# EAGLE schematic connectors (EAGLE 9.6.2)
Assembly variants: basic
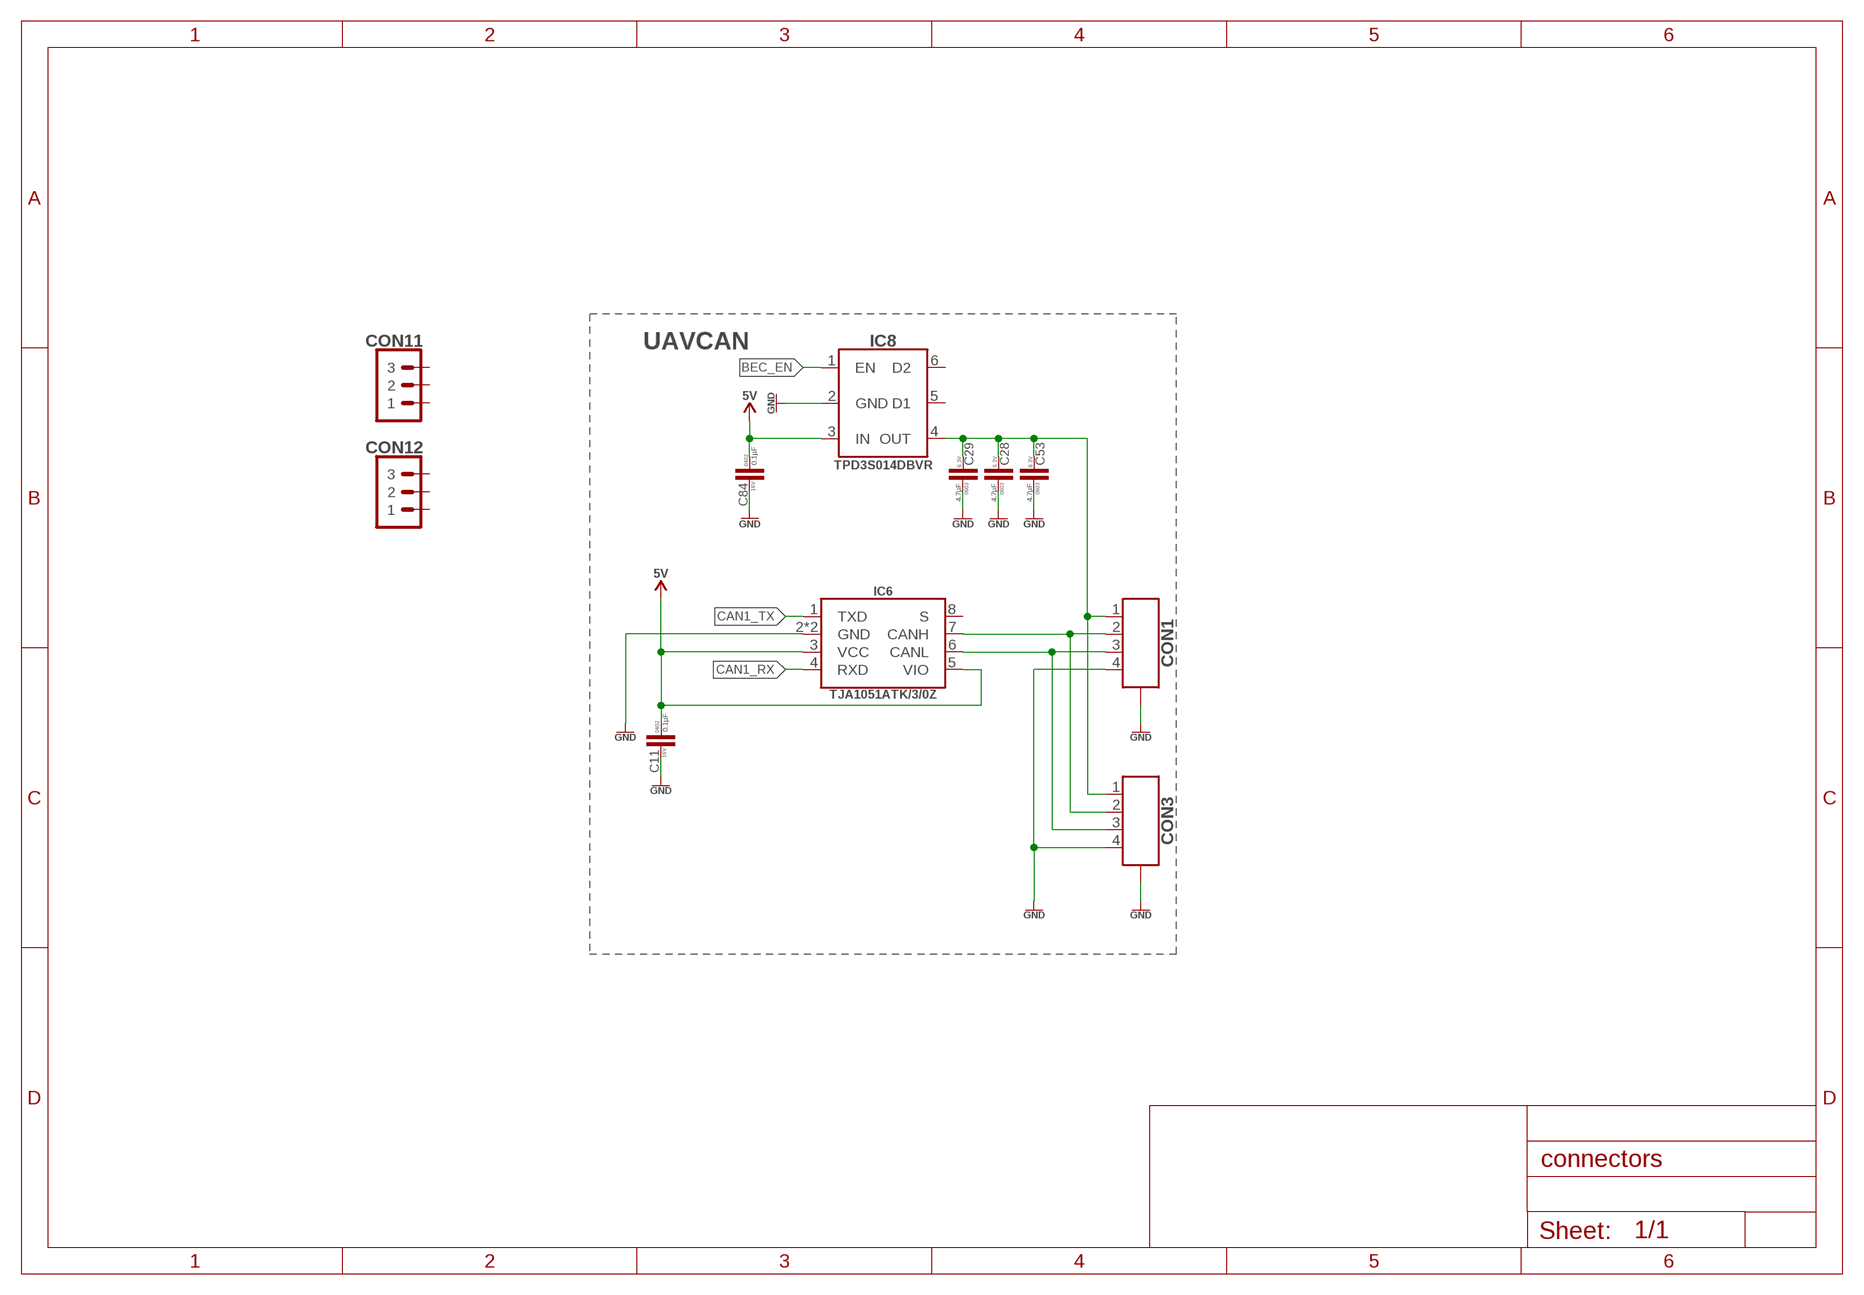
[diagram p0: schematic, sheet 1]

## Parts
C11  0.1µF  C-0402  [C0402]
C28  4.7µF  C-0603  [C0603]
C29  4.7µF  C-0603  [C0603]
C53  4.7µF  C-0603  [C0603]
C84  0.1µF  C-0402  [C0402]
CON1  CON-4P-TABS-JST_GH-RA  [JST_GH-4P-RA]
CON3  CON-4P-TABS-JST_GH-RA  [JST_GH-4P-RA]
CON11  PINHEAD_1X03-2  [1X03-PTH-2]
CON12  PINHEAD_1X03-2  [1X03-PTH-2]
IC6  TJA1051-HVSON8  [SOT782-1]
IC8  TPD3S014DBVR-SOT23-6  [SOT26]

## Nets
BEC_EN: IC8.1(EN)
CAN1_RX: IC6.4(RXD)
CAN1_TX: IC6.1(TXD)
CAN1_VDD: C28.2 C29.2 C53.2 CON1.1 CON3.1 IC8.4(OUT)
GND: C11.2 C28.1 C29.1 C53.1 C84.2 CON1.4 CON1.M$0(GND) CON1.M$1(GND) CON3.4 CON3.M$0(GND) CON3.M$1(GND) IC6.2(GND) IC6.PAD(GND) IC8.2(GND)
N$23: CON1.2 CON3.2 IC6.7(CANH)
N$25: CON1.3 CON3.3 IC6.6(CANL)
VDD_5V: C11.1 C84.1 IC6.3(VCC) IC6.5(VIO) IC8.3(IN) ; supply symbol labelled 5V
Unconnected: CON11.1 CON11.2 CON11.3 CON12.1 CON12.2 CON12.3 IC6.8(S) IC8.5(D1) IC8.6(D2)

## Notes on the sheet
- UAVCAN

## Library data of the parts
C11 C84 = rc:C; AEC-Q: ---; DIGIKEY#: 490-3261-1-ND; MANF: Murata Electronics; MANF#: GRM155R71C104KA88D; OPERATING_TEMP: -55°C ~ 125°C; PACKAGE: 0402; VOLTAGE: 16V
C28 C29 C53 = rc:C; AEC-Q: ---; DIGIKEY#: 1276-2087-1-ND; MANF: Samsung Electro-Mechanics; MANF#: CL10B475KQ8NQNC; OPERATING_TEMP: -55°C ~ 125°C; PACKAGE: 0603; VOLTAGE: 6.3V
CON1 CON3 = Connectors:CON-4P-TABS: Connector Receptacle 4 Position 0.049" (1.25mm) Tin Surface Mount; DIGIKEY#: 455-1566-1-ND; MANF: JST Sales America Inc; MANF#: SM04B-GHS-TB(LF)(SN)
CON11 CON12 = pinhead:PINHEAD_1X03: pinheader 3P
IC6 = serial_interfaces:TJA1051: 1/1 Transceiver Half CAN 8-HVSON (3x3); AEC-Q: AEC-Q100; DATA_RATE: 5Mbps; DIGIKEY#: 568-TJA1051ATK/3/0ZTR-ND; MANF: NXP USA Inc.; MANF#: TJA1051ATK/3/0Z; VOLTAGE_SUPPLY: 4.5V ~ 5.5V
IC8 = misc:TPD3S014DBVR: Current Switch Regulator High-Side 500mA SOT-23-6; DIGIKEY#: 296-38835-1-ND; MANF: Texas Instruments; MANF#: TPD3S014DBVR